# Altium schematic sheet MCU.SchDoc
size C; SheetNumber: 5; SheetTotal: 15
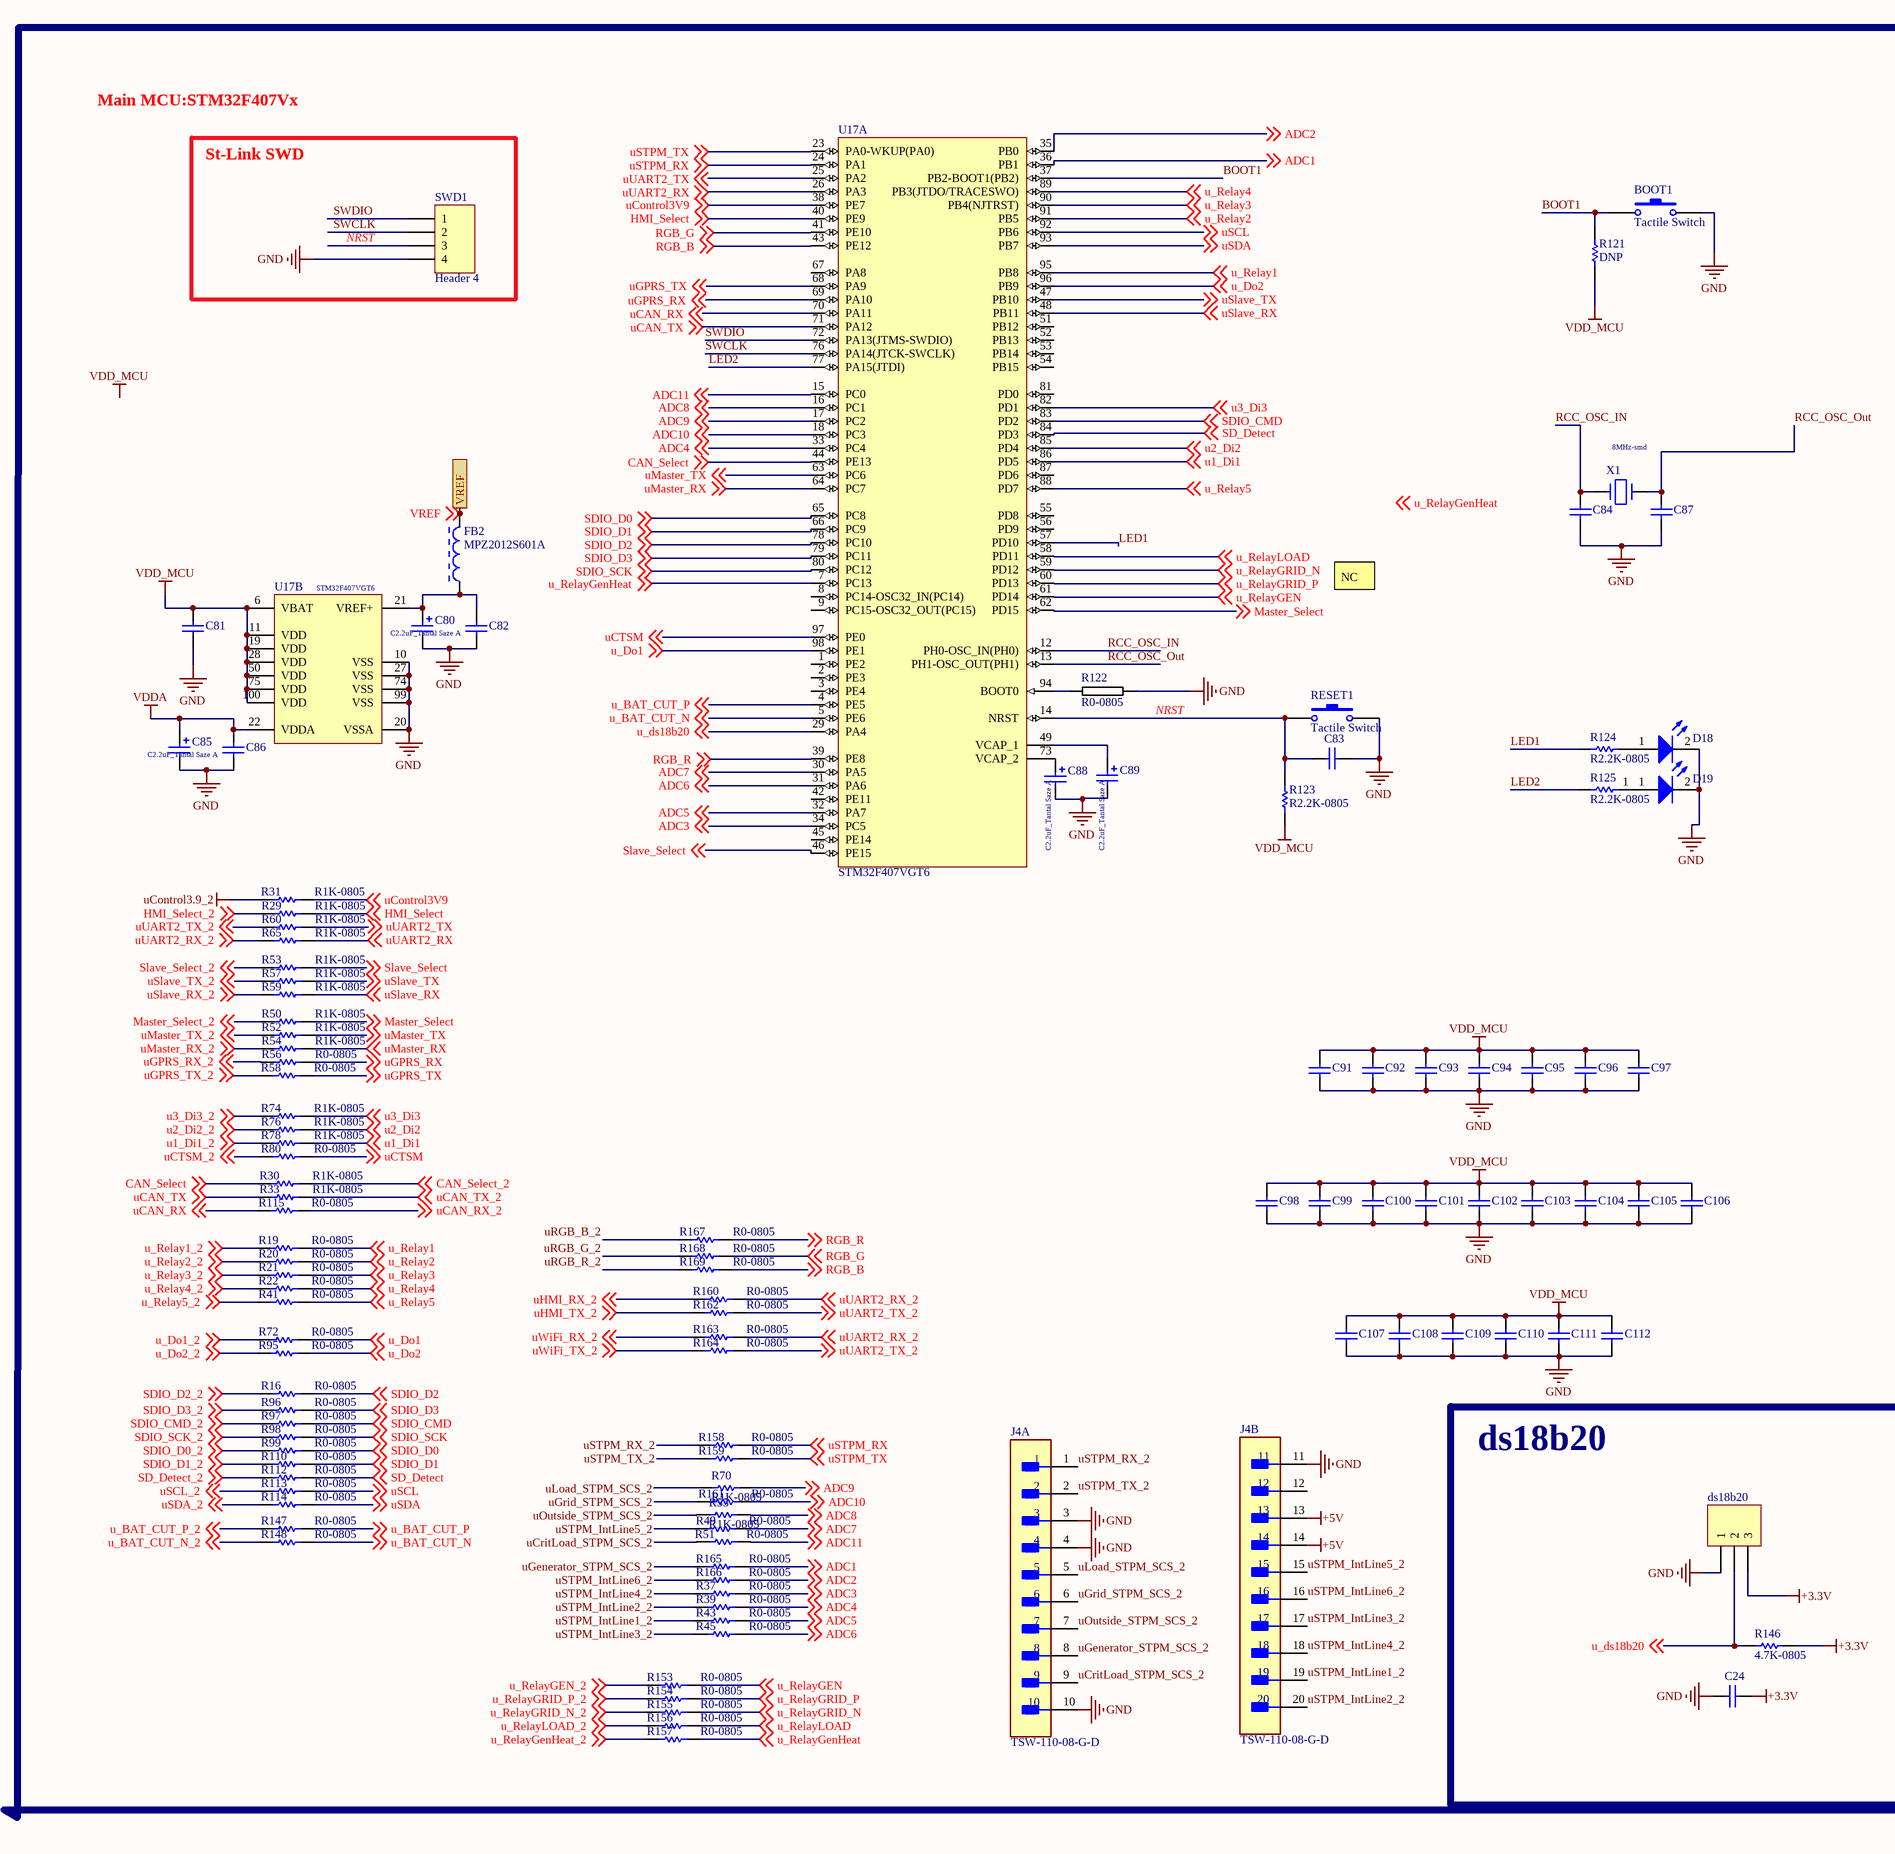
[diagram p0: MCU.SchDoc, left]
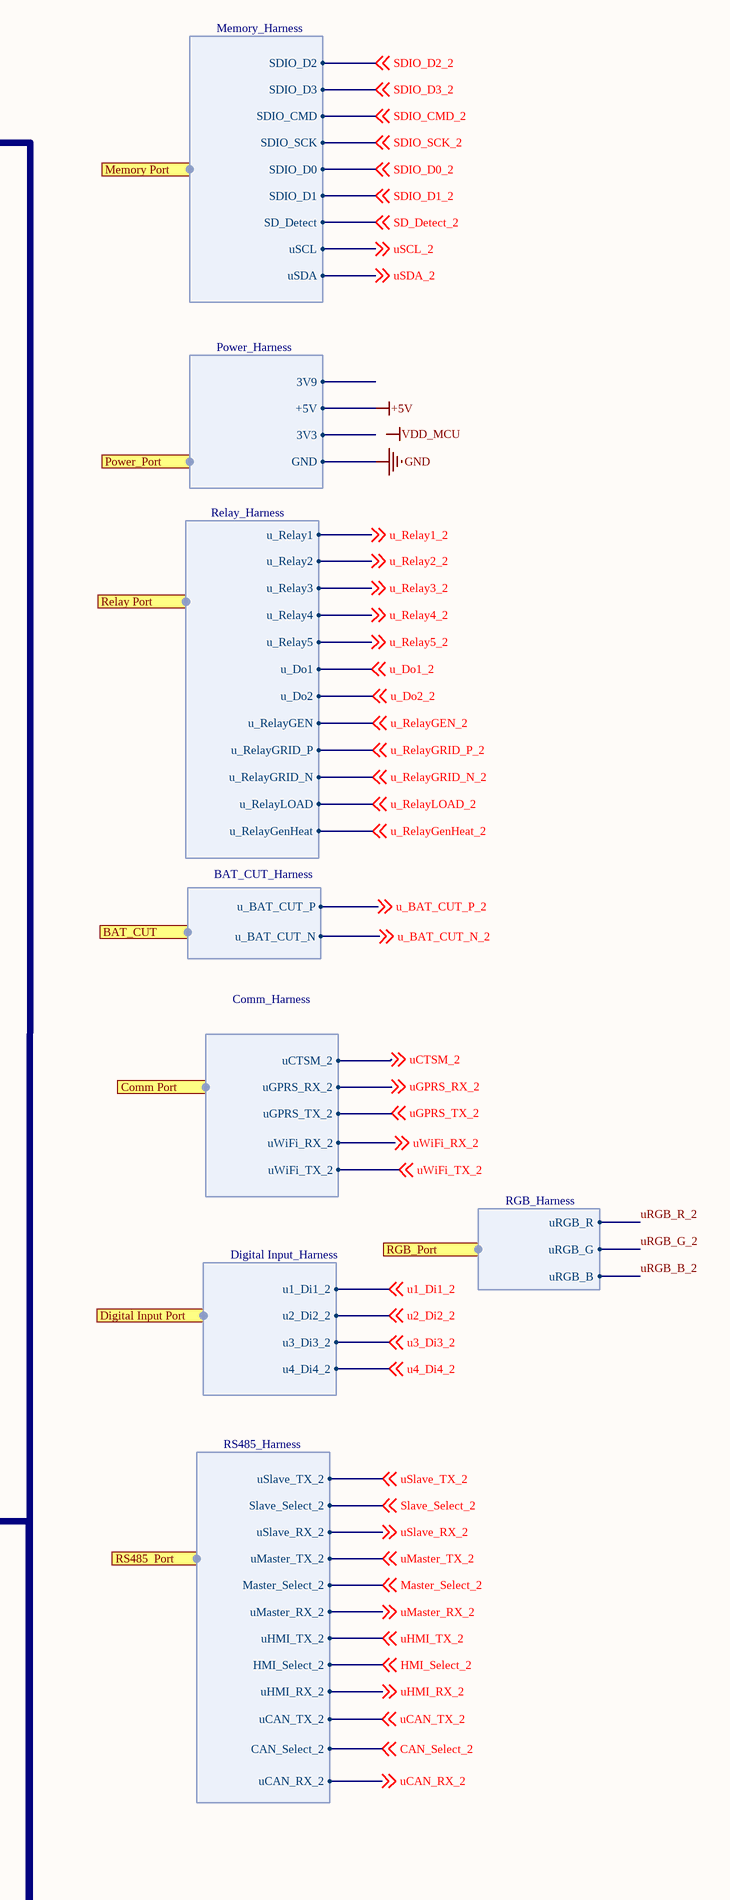
[diagram p1: MCU.SchDoc, right]

## Parts
BOOT1  Tactile Switch  [CRF06031]
C24  (no value)  [CRF06031]
C80  C2.2uF_Tantal Saze A  [Tantalium Size A]
C81  (no value)  [CRF06031]
C82  (no value)  [CRF06031]
C83  (no value)  [CRF06031]
C84  (no value)  [CRF06031]
C85  C2.2uF_Tantal Saze A  [Tantalium Size A]
C86  (no value)  [CRF06031]
C87  (no value)  [CRF06031]
C88  C2.2uF_Tantal Saze A  [Tantalium Size A]
C89  C2.2uF_Tantal Saze A  [Tantalium Size A]
C91  (no value)  [CRF06031]
C92  (no value)  [CRF06031]
C93  (no value)  [CRF06031]
C94  (no value)  [CRF06031]
C95  (no value)  [CRF06031]
C96  (no value)  [CRF06031]
C97  (no value)  [CRF06031]
C98  (no value)  [CRF06031]
C99  (no value)  [CRF06031]
C100  (no value)  [CRF06031]
C101  (no value)  [CRF06031]
C102  (no value)  [CRF06031]
C103  (no value)  [CRF06031]
C104  (no value)  [CRF06031]
C105  (no value)  [CRF06031]
C106  (no value)  [CRF06031]
C107  (no value)  [CRF06031]
C108  (no value)  [CRF06031]
C109  (no value)  [CRF06031]
C110  (no value)  [CRF06031]
C111  (no value)  [CRF06031]
C112  (no value)  [CRF06031]
D18  LED_0805_green  [0805-LED]  (value not drawn)
D19  LED_0805_red  [0805-LED]  (value not drawn)
ds18b20  LM35-DIP  [TO-92 STR]  (value not drawn)
FB2  MPZ2012S601A  [TDK-MPZ2012_V]
J4  TSW-110-08-G-D  [FP-TSW-110-08-G-D-MFG]  (parts A,B of 2)
R16  R0-0805  [CRF06031]
R19  R0-0805  [CRF06031]
R20  R0-0805  [CRF06031]
R21  R0-0805  [CRF06031]
R22  R0-0805  [CRF06031]
R29  R1K-0805  [CRF06031]
R30  R1K-0805  [CRF06031]
R31  R1K-0805  [CRF06031]
R33  R1K-0805  [CRF06031]
R37  R0-0805  [CRF06031]
R39  R0-0805  [CRF06031]
R41  R0-0805  [CRF06031]
R43  R0-0805  [CRF06031]
R45  R0-0805  [CRF06031]
R49  R0-0805  [CRF06031]
R50  R1K-0805  [CRF06031]
R51  R0-0805  [CRF06031]
R52  R1K-0805  [CRF06031]
R53  R1K-0805  [CRF06031]
R54  R1K-0805  [CRF06031]
R55  R1K-0805  [CRF06031]
R56  R0-0805  [CRF06031]
R57  R1K-0805  [CRF06031]
R58  R0-0805  [CRF06031]
R59  R1K-0805  [CRF06031]
R60  R1K-0805  [CRF06031]
R65  R1K-0805  [CRF06031]
R70  R1K-0805  [CRF06031]
R72  R0-0805  [CRF06031]
R74  R1K-0805  [CRF06031]
R76  R1K-0805  [CRF06031]
R78  R1K-0805  [CRF06031]
R80  R0-0805  [CRF06031]
R95  R0-0805  [CRF06031]
R96  R0-0805  [CRF06031]
R97  R0-0805  [CRF06031]
R98  R0-0805  [CRF06031]
R99  R0-0805  [CRF06031]
R110  R0-0805  [CRF06031]
R112  R0-0805  [CRF06031]
R113  R0-0805  [CRF06031]
R114  R0-0805  [CRF06031]
R115  R0-0805  [CRF06031]
R121  DNP  [CRF06031]
R122  R0-0805  [CRF06031]
R123  R2.2K-0805  [CRF06031]
R124  R2.2K-0805  [CRF06031]
R125  R2.2K-0805  [CRF06031]
R146  4.7K-0805  [CRF06031]
R147  R0-0805  [CRF06031]
R148  R0-0805  [CRF06031]
R153  R0-0805  [CRF06031]
R154  R0-0805  [CRF06031]
R155  R0-0805  [CRF06031]
R156  R0-0805  [CRF06031]
R157  R0-0805  [CRF06031]
R158  R0-0805  [CRF06031]
R159  R0-0805  [CRF06031]
R160  R0-0805  [CRF06031]
R161  R0-0805  [CRF06031]
R162  R0-0805  [CRF06031]
R163  R0-0805  [CRF06031]
R164  R0-0805  [CRF06031]
R165  R0-0805  [CRF06031]
R166  R0-0805  [CRF06031]
R167  R0-0805  [CRF06031]
R168  R0-0805  [CRF06031]
R169  R0-0805  [CRF06031]
RESET1  Tactile Switch  [CRF06031]
SWD1  Header 4  [HDR1X4]
U17  STM32F407VGT6  [STM-LQFP100_N]  (parts A,B of 2)
X1  8MHz-smd  [smd xtal 16M]

## Blocks framed on the sheet
St-Link SWD: SWD1

## Ports
BAT_CUT (harness BAT_CUT_Harness), Comm Port (harness Comm_Harness), Digital Input Port (harness Digital Input_Harness), Memory Port (harness Memory_Harness), Power_Port (harness Power_Harness), Relay Port (harness Relay_Harness), RGB_Port (harness RGB_Harness), RS485  Port (harness RS485_Harness), VREF

## Harnesses
Memory_Harness: SDIO_D3, SDIO_CMD, SDIO_SCK, SDIO_D0, SDIO_D1, SD_Detect, uSCL, SDIO_D2, uSDA
Power_Harness: 3V9, +5V, 3V3, GND
BAT_CUT_Harness: u_BAT_CUT_P, u_BAT_CUT_N
Digital Input_Harness: u1_Di1_2, u2_Di2_2, u3_Di3_2, u4_Di4_2
RS485_Harness: uSlave_TX_2, Slave_Select_2, uSlave_RX_2, uMaster_TX_2, Master_Select_2, uMaster_RX_2, uHMI_TX_2, HMI_Select_2, uHMI_RX_2, uCAN_TX_2, CAN_Select_2, uCAN_RX_2
Comm_Harness: uCTSM_2, uGPRS_RX_2, uGPRS_TX_2, uWiFi_TX_2, uWiFi_RX_2
Relay_Harness: u_Relay1, u_Relay2, u_Relay3, u_Relay4, u_Relay5, u_Do1, u_Do2, u_RelayGEN, u_RelayGRID_P, u_RelayGRID_N, u_RelayLOAD, u_RelayGenHeat
RGB_Harness: uRGB_R, uRGB_G, uRGB_B

## Nets
+3.3V: C24.2 ds18b20.3 R146.2
+5V: J4.13 J4.14 ; port Power_Port.+5V
GND: BOOT1.2 C24.1 C80.2 C81.2 C82.2 C83.2 C84.1 C85.2 C86.2 C87.1 C88.2 C89.2 C91.2 C92.2 C93.2 C94.2 C95.2 C96.2 C97.2 C98.2 C99.2 C100.2 C101.2 C102.2 C103.2 C104.2 C105.2 C106.2 C107.2 C108.2 C109.2 C110.2 C111.2 C112.2 D18.2(K) D19.2(K) ds18b20.1 J4.3 J4.4 J4.10 J4.11 R122.2 RESET1.2 SWD1.4 U17.10(VSS) U17.20(VSSA) U17.27(VSS) U17.74(VSS) U17.99(VSS) ; port Power_Port.GND
uControl3.9_2: R31.2
VDD_MCU: C81.1 C91.1 C92.1 C93.1 C94.1 C95.1 C96.1 C97.1 C98.1 C99.1 C100.1 C101.1 C102.1 C103.1 C104.1 C105.1 C106.1 C107.1 C108.1 C109.1 C110.1 C111.1 C112.1 R121.1 R123.1 U17.6(VBAT) U17.11(VDD) U17.19(VDD) U17.28(VDD) U17.50(VDD) U17.75(VDD) U17.100(VDD)
VDDA: C85.1 C86.1 U17.22(VDDA)
ADC1: R165.1 U17.36(PB1) ; off-sheet ADC1
ADC2: R166.1 U17.35(PB0) ; off-sheet ADC2
ADC3: R37.1 U17.34(PC5) ; off-sheet ADC3
ADC4: R39.1 U17.33(PC4) ; off-sheet ADC4
ADC5: R43.1 U17.32(PA7) ; off-sheet ADC5
ADC6: R45.1 U17.31(PA6) ; off-sheet ADC6
ADC7: R49.1 U17.30(PA5) ; off-sheet ADC7
ADC8: R55.2 U17.16(PC1) ; off-sheet ADC8
ADC9: R70.2 U17.17(PC2) ; off-sheet ADC9
ADC10: R161.1 U17.18(PC3) ; off-sheet ADC10
ADC11: R51.2 U17.15(PC0) ; off-sheet ADC11
BOOT1: BOOT1.1 R121.2 U17.37(PB2-BOOT1(PB2))
CAN_Select: R30.2 U17.44(PE13) ; off-sheet CAN_Select
CAN_Select_2: R30.1 ; off-sheet CAN_Select_2, port RS485  Port.CAN_Select_2
HMI_Select: R29.1 U17.40(PE9) ; off-sheet HMI_Select
HMI_Select_2: R29.2 ; off-sheet HMI_Select_2, port RS485  Port.HMI_Select_2
LED1: R124.2 U17.57(PD10)
LED2: R125.2 U17.77(PA15(JTDI))
Master_Select: R50.1 U17.62(PD15) ; off-sheet Master_Select
Master_Select_2: R50.2 ; off-sheet Master_Select_2, port RS485  Port.Master_Select_2
NRST: C83.1 R123.2 RESET1.1 SWD1.3 U17.14(NRST)
RCC_OSC_IN: C84.2 U17.12(PH0-OSC_IN(PH0)) X1.1
RCC_OSC_Out: C87.2 U17.13(PH1-OSC_OUT(PH1)) X1.2
RGB_B: R169.1 U17.43(PE12) ; off-sheet RGB_B
RGB_G: R168.1 U17.41(PE10) ; off-sheet RGB_G
RGB_R: R167.1 U17.39(PE8) ; off-sheet RGB_R
SD_Detect: R112.1 U17.84(PD3) ; off-sheet SD_Detect
SD_Detect_2: R112.2 ; off-sheet SD_Detect_2, port Memory Port.SD_Detect
SDIO_CMD: R97.1 U17.83(PD2) ; off-sheet SDIO_CMD
SDIO_CMD_2: R97.2 ; off-sheet SDIO_CMD_2, port Memory Port.SDIO_CMD
SDIO_D0: R99.1 U17.65(PC8) ; off-sheet SDIO_D0
SDIO_D0_2: R99.2 ; off-sheet SDIO_D0_2, port Memory Port.SDIO_D0
SDIO_D1: R110.1 U17.66(PC9) ; off-sheet SDIO_D1
SDIO_D1_2: R110.2 ; off-sheet SDIO_D1_2, port Memory Port.SDIO_D1
SDIO_D2: R16.1 U17.78(PC10) ; off-sheet SDIO_D2
SDIO_D2_2: R16.2 ; off-sheet SDIO_D2_2, port Memory Port.SDIO_D2
SDIO_D3: R96.1 U17.79(PC11) ; off-sheet SDIO_D3
SDIO_D3_2: R96.2 ; off-sheet SDIO_D3_2, port Memory Port.SDIO_D3
SDIO_SCK: R98.1 U17.80(PC12) ; off-sheet SDIO_SCK
SDIO_SCK_2: R98.2 ; off-sheet SDIO_SCK_2, port Memory Port.SDIO_SCK
Slave_Select: R53.1 U17.46(PE15) ; off-sheet Slave_Select
Slave_Select_2: R53.2 ; off-sheet Slave_Select_2, port RS485  Port.Slave_Select_2
SWCLK: SWD1.2 U17.76(PA14(JTCK-SWCLK))
SWDIO: SWD1.1 U17.72(PA13(JTMS-SWDIO))
u1_Di1: R78.1 U17.86(PD5) ; off-sheet u1_Di1
u1_Di1_2: R78.2 ; off-sheet u1_Di1_2, port Digital Input Port.u1_Di1_2
u2_Di2: R76.1 U17.85(PD4) ; off-sheet u2_Di2
u2_Di2_2: R76.2 ; off-sheet u2_Di2_2, port Digital Input Port.u2_Di2_2
u3_Di3: R74.1 U17.82(PD1) ; off-sheet u3_Di3
u3_Di3_2: R74.2 ; off-sheet u3_Di3_2, port Digital Input Port.u3_Di3_2
u4_Di4_2: off-sheet u4_Di4_2, port Digital Input Port.u4_Di4_2
u_BAT_CUT_N: R148.1 U17.5(PE6) ; off-sheet u_BAT_CUT_N
u_BAT_CUT_N_2: R148.2 ; off-sheet u_BAT_CUT_N_2, port BAT_CUT.u_BAT_CUT_N
u_BAT_CUT_P: R147.1 U17.4(PE5) ; off-sheet u_BAT_CUT_P
u_BAT_CUT_P_2: R147.2 ; off-sheet u_BAT_CUT_P_2, port BAT_CUT.u_BAT_CUT_P
u_Do1: R72.1 U17.98(PE1) ; off-sheet u_Do1
u_Do1_2: R72.2 ; off-sheet u_Do1_2, port Relay Port.u_Do1
u_Do2: R95.1 U17.96(PB9) ; off-sheet u_Do2
u_Do2_2: R95.2 ; off-sheet u_Do2_2, port Relay Port.u_Do2
u_ds18b20: ds18b20.2 R146.1 U17.29(PA4) ; off-sheet u_ds18b20
u_Relay1: R19.1 U17.95(PB8) ; off-sheet u_Relay1
u_Relay1_2: R19.2 ; off-sheet u_Relay1_2, port Relay Port.u_Relay1
u_Relay2: R20.1 U17.91(PB5) ; off-sheet u_Relay2
u_Relay2_2: R20.2 ; off-sheet u_Relay2_2, port Relay Port.u_Relay2
u_Relay3: R21.1 U17.90(PB4(NJTRST)) ; off-sheet u_Relay3
u_Relay3_2: R21.2 ; off-sheet u_Relay3_2, port Relay Port.u_Relay3
u_Relay4: R22.1 U17.89(PB3(JTDO/TRACESWO)) ; off-sheet u_Relay4
u_Relay4_2: R22.2 ; off-sheet u_Relay4_2, port Relay Port.u_Relay4
u_Relay5: R41.1 U17.88(PD7) ; off-sheet u_Relay5
u_Relay5_2: R41.2 ; off-sheet u_Relay5_2, port Relay Port.u_Relay5
u_RelayGEN: R153.1 U17.61(PD14) ; off-sheet u_RelayGEN
u_RelayGEN_2: R153.2 ; off-sheet u_RelayGEN_2, port Relay Port.u_RelayGEN
u_RelayGenHeat: R157.1 U17.7(PC13) ; off-sheet u_RelayGenHeat
u_RelayGenHeat_2: R157.2 ; off-sheet u_RelayGenHeat_2, port Relay Port.u_RelayGenHeat
u_RelayGRID_N: R155.1 U17.59(PD12) ; off-sheet u_RelayGRID_N
u_RelayGRID_N_2: R155.2 ; off-sheet u_RelayGRID_N_2, port Relay Port.u_RelayGRID_N
u_RelayGRID_P: R154.1 U17.60(PD13) ; off-sheet u_RelayGRID_P
u_RelayGRID_P_2: R154.2 ; off-sheet u_RelayGRID_P_2, port Relay Port.u_RelayGRID_P
u_RelayLOAD: R156.1 U17.58(PD11) ; off-sheet u_RelayLOAD
u_RelayLOAD_2: R156.2 ; off-sheet u_RelayLOAD_2, port Relay Port.u_RelayLOAD
uCAN_RX: R115.2 U17.70(PA11) ; off-sheet uCAN_RX
uCAN_RX_2: R115.1 ; off-sheet uCAN_RX_2, port RS485  Port.uCAN_RX_2
uCAN_TX: R33.2 U17.71(PA12) ; off-sheet uCAN_TX
uCAN_TX_2: R33.1 ; off-sheet uCAN_TX_2, port RS485  Port.uCAN_TX_2
uControl3V9: R31.1 U17.38(PE7) ; off-sheet uControl3V9
uCritLoad_STPM_SCS_2: J4.9 R51.1
uCTSM: R80.1 U17.97(PE0) ; off-sheet uCTSM
uCTSM_2: R80.2 ; off-sheet uCTSM_2, port Comm Port.uCTSM_2
uGenerator_STPM_SCS_2: J4.8 R165.2
uGPRS_RX: R56.1 U17.69(PA10) ; off-sheet uGPRS_RX
uGPRS_RX_2: R56.2 ; off-sheet uGPRS_RX_2, port Comm Port.uGPRS_RX_2
uGPRS_TX: R58.1 U17.68(PA9) ; off-sheet uGPRS_TX
uGPRS_TX_2: R58.2 ; off-sheet uGPRS_TX_2, port Comm Port.uGPRS_TX_2
uGrid_STPM_SCS_2: J4.6 R161.2
uHMI_RX_2: R160.2 ; off-sheet uHMI_RX_2, port RS485  Port.uHMI_RX_2
uHMI_TX_2: R162.2 ; off-sheet uHMI_TX_2, port RS485  Port.uHMI_TX_2
uLoad_STPM_SCS_2: J4.5 R70.1
uMaster_RX: R54.1 U17.64(PC7) ; off-sheet uMaster_RX
uMaster_RX_2: R54.2 ; off-sheet uMaster_RX_2, port RS485  Port.uMaster_RX_2
uMaster_TX: R52.1 U17.63(PC6) ; off-sheet uMaster_TX
uMaster_TX_2: R52.2 ; off-sheet uMaster_TX_2, port RS485  Port.uMaster_TX_2
uOutside_STPM_SCS_2: J4.7 R55.1
uRGB_B_2: R167.2 ; port RGB_Port.uRGB_B
uRGB_G_2: R168.2 ; port RGB_Port.uRGB_G
uRGB_R_2: R169.2 ; port RGB_Port.uRGB_R
uSCL: R113.1 U17.92(PB6) ; off-sheet uSCL
uSCL_2: R113.2 ; off-sheet uSCL_2, port Memory Port.uSCL
uSDA: R114.1 U17.93(PB7) ; off-sheet uSDA
uSDA_2: R114.2 ; off-sheet uSDA_2, port Memory Port.uSDA
uSlave_RX: R59.1 U17.48(PB11) ; off-sheet uSlave_RX
uSlave_RX_2: R59.2 ; off-sheet uSlave_RX_2, port RS485  Port.uSlave_RX_2
uSlave_TX: R57.1 U17.47(PB10) ; off-sheet uSlave_TX
uSlave_TX_2: R57.2 ; off-sheet uSlave_TX_2, port RS485  Port.uSlave_TX_2
uSTPM_IntLine1_2: J4.19 R43.2
uSTPM_IntLine2_2: J4.20 R39.2
uSTPM_IntLine3_2: J4.17 R45.2
uSTPM_IntLine4_2: J4.18 R37.2
uSTPM_IntLine5_2: J4.15 R49.2
uSTPM_IntLine6_2: J4.16 R166.2
uSTPM_RX: R158.1 U17.24(PA1) ; off-sheet uSTPM_RX
uSTPM_RX_2: J4.1 R158.2
uSTPM_TX: R159.1 U17.23(PA0-WKUP(PA0)) ; off-sheet uSTPM_TX
uSTPM_TX_2: J4.2 R159.2
uUART2_RX: R65.1 U17.26(PA3) ; off-sheet uUART2_RX
uUART2_RX_2: R65.2 R160.1 R163.1 ; off-sheet uUART2_RX_2
uUART2_TX: R60.1 U17.25(PA2) ; off-sheet uUART2_TX
uUART2_TX_2: R60.2 R162.1 R164.1 ; off-sheet uUART2_TX_2
uWiFi_RX_2: R163.2 ; off-sheet uWiFi_RX_2, port Comm Port.uWiFi_RX_2
uWiFi_TX_2: R164.2 ; off-sheet uWiFi_TX_2, port Comm Port.uWiFi_TX_2
VREF: FB2.2 ; off-sheet VREF, port VREF
NetC80_1: C80.1 C82.1 FB2.1 U17.21(VREF+)
NetC88_1: C88.1 U17.73(VCAP_2)
NetC89_1: C89.1 U17.49(VCAP_1)
NetD18_1: D18.1(A) R124.1
NetD19_1: D19.1(A) R125.1
NetR122_1: R122.1 U17.94(BOOT0)

Not connected (* = marked no-connect by the designer): J4 12; U17 1(PE2) 2(PE3) 3(PE4) 8(PC14-OSC32_IN(PC14)) 9(PC15-OSC32_OUT(PC15)) 42(PE11) 45(PE14) 51(PB12) 52(PB13) 53(PB14) 54(PB15) 55(PD8) 56(PD9) 67(PA8) 81(PD0) 87(PD6)

## Notes on the sheet
- Main MCU:STM32F407Vx
- NC
- ds18b20
- Labels drawn without touching a wire or pin: u_RelayGenHeat, VDD_MCU

## Library data of the parts
BOOT1 RESET1 = Switch PB: Manufacturer_P/N: 430152043836; Digi-Key_Part_Number: 732-6992-2-ND; ClassName: MCU; JLC P/N: C6687535
C24 C81-C83 C86 C91-C112 = Cap: Capacitor; Manufacturer_P/N: GCM21BR72A104KA37L; Digi-Key_Part_Number: 490-4789-1-ND; JLC P/N: C85866
  C81-C83 C86 C91-C112: ClassName: MCU
C80 C85 C88 C89 = Cap_10uF_POL_10%_TANA: Polarized Capacitor,2.2uF,10V,typeA; Manuf_1: VISHAY; Manuf_Part_1: 293D106X9010A2TE3; Manufacturer_P/N: 293D225X0016A2TE3; Revision: July-2002: Re-released for DXP Platform.; Digi-Key_Part_Number: 718-2135-2-ND; ClassName: MCU; JLC P/N: C1954029
C84 C87 = Cap: Capacitor; Manufacturer_P/N: GRM21A5C2E220JW01D; Digi-Key_Part_Number: 490-5534-2-ND; ClassName: MCU; JLC P/N: C668358
D18 D19 = LED_0805: Manufacturer_P/N: NCD0805R1; ClassName: MCU; JLC P/N: C84256
ds18b20 = Header 3: LM35-TO92; Manufacturer_P/N: DS18B20+T&R; Digi-Key_Part_Number: DS18B20+T&RTR-ND; JLC P/N: C880672
FB2 = CMP-2000-05400-1: Chip Bead for Power Line, 600 Ohm, +/- 25%, 2 A, -55 to 125 degC, 2-Pin SMD (0805), RoHS, Tape and Reel; Manufacturer_P/N: MPZ2012S601AT000; Maximum DC Current: 2A; Maximum DC Resistance: 100mOhms; Manufacturer URL: http://www.tdk.com/; Product: FerriteChipBeads; Digi-Key_Part_Number: 445-MPZ2012S601AT000TR-ND; ClassName: MCU; JLC P/N: C21519
J4 = CMP-02766-000083-1: CONN HEADER VERT 20POS 2.54MM; Manufacturer Part Number: TSW-110-08-G-D; Temperature: -55°C to +125°C; Digikey Description: CONN HEADER VERT 20POS 2.54MM; Octopart: https://octopart.com/tsw-110-08-g-d-samtec-272555; Digi-Key_Part_Number: SAM1036-10-ND; Manufacturer_P/N: TSW-110-08-G-D; JLC P/N: C5804552
R16 R19-R22 R37 R39 R41 R43 R45 R49 R51 R56 R58 R72 R80 R95-R99 R110 R112-R115 R147 R148 R153-R169 = Res1: Resistor; Manufacturer_P/N: RC0805FR-070RL; Digi-Key_Part_Number: 311-0.0CRTR-ND; JLC P/N: C100045
  R16 R19-R22 R37 R39 R41 R43 R45 R49 R51 R56 R58 R72 R80 R95-R99 R110 R112-R115 R147 R148 R153-R159 R161 R165 R166: ClassName: MCU
R29-R31 R33 R50 R52-R55 R57 R59 R60 R65 R70 R74 R76 R78 = Res1: Resistor; Manufacturer_P/N: RC0805FR-071KL; Digi-Key_Part_Number: 311-1.00KCRTR-ND; ClassName: MCU; JLC P/N: C95781
R121 = Res1: ClassName: MCU
R122 = 0805R-10K: RESISTOR 0805 1/4 WATT THIN FILM; Manufacturer_P/N: RC0805FR-070RL; Digi-Key_Part_Number: 311-0.0CRTR-ND; ClassName: MCU; JLC P/N: C100045
R123-R125 = Res1: Resistor; Manufacturer_P/N: RC0805FR-072K2L; Digi-Key_Part_Number: 311-2.20KCRTR-ND; ClassName: MCU; JLC P/N: C114561
R146 = Res1: Resistor; Manufacturer_P/N: RC0805FR-074K7L; Digi-Key_Part_Number: 311-4.70KCRTR-ND; ClassName: MCU; JLC P/N: C60816
SWD1 = Header 4: Header, 4-Pin
U17 = STM32F407VGT6: ARM Cortex-M4 32-bit MCU+FPU, 210 DMIPS, 1024 kB Flash, 192 kB Internal RAM, 82 I/Os, 100-pin LQFP, -40 to 85 degC, Tray; Supplier 1: Digi-Key; Supplier Part Number 1: 497-11605-ND; Supplier 2: Farnell; Supplier Part Number 2: 2064368; Supplier 3: Newark; Supplier Part Number 3: 73T2333; Supplier 4: Mouser; Supplier Part Number 4: 511-STM32F407VGT6; PartNumber: STM32F407VGT6; Digi-Key_Part_Number: 497-11605-ND; ClassName: MCU_u; Manufacturer_P/N: STM32F407VGT6; JLC P/N: C12345
X1 = CRYSTAL: Manufacturer_P/N: ECS-80-20-5G3XDS-TR; Digi-Key_Part_Number: XC1494TR-ND; ClassName: MCU; JLC P/N: C2441330